# EAGLE design booz_power_board (EAGLE 4.16)
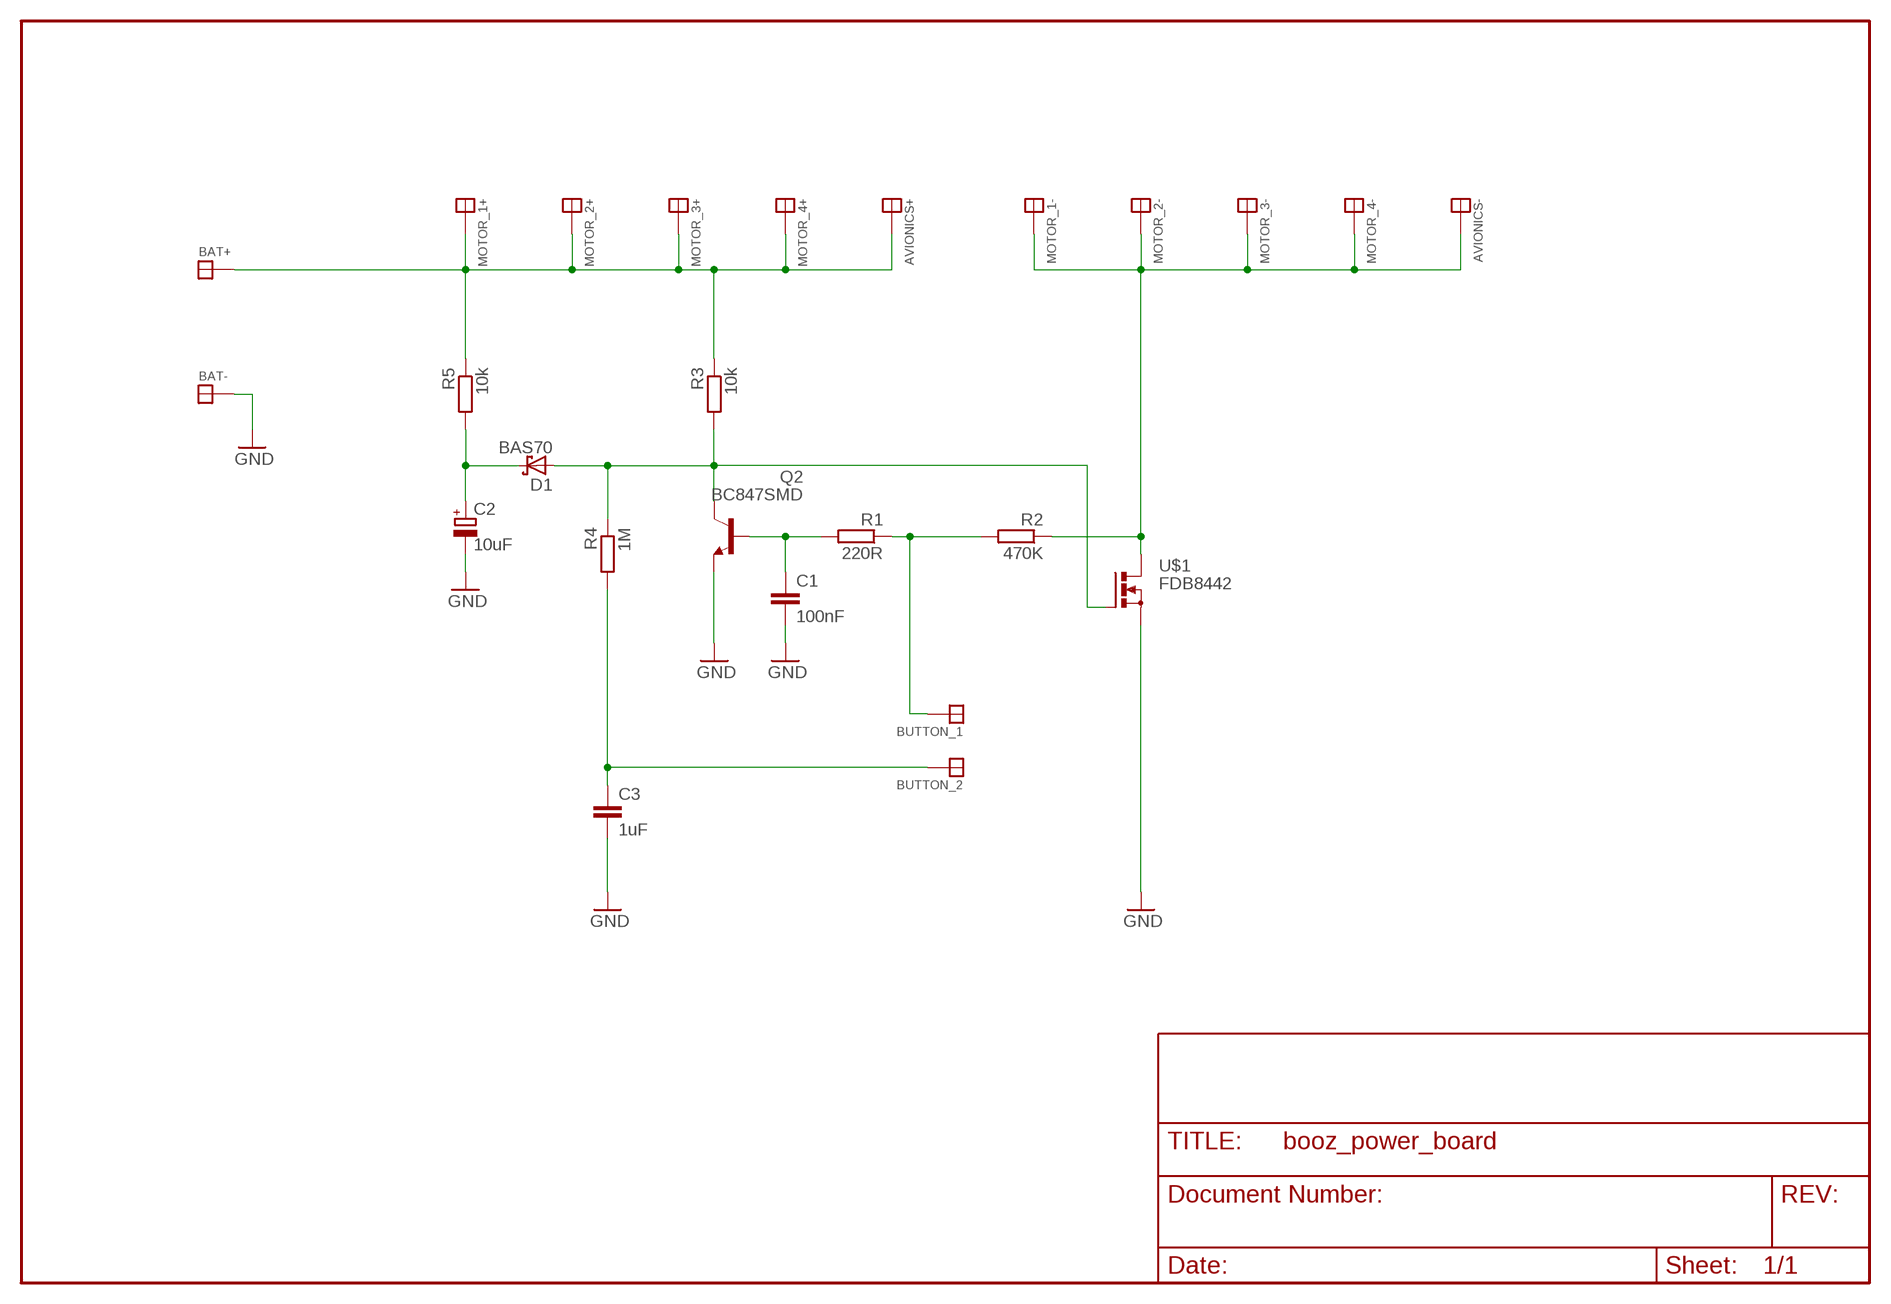
[diagram p0: schematic, sheet 1]

## Parts
AVIONICS+  SOLDER_PAD100_50  [SOLDER_PAD_100_50]
AVIONICS-  SOLDER_PAD100_50  [SOLDER_PAD_100_50]
BAT+  SOLDER_PAD100_50  [SOLDER_PAD_100_50]
BAT-  SOLDER_PAD100_50  [SOLDER_PAD_100_50]
BUTTON_1  SOLDER_PAD100_50  [SOLDER_PAD_100_50]
BUTTON_2  SOLDER_PAD100_50  [SOLDER_PAD_100_50]
C1  100nF  C-EUC0603  [C0603]
C2  10uF  CPOL-EUSMCA  [SMC_A]
C3  1uF  C-EUC0603  [C0603]
D1  BAS70  [SOT23]
MOTOR_1+  SOLDER_PAD100_50  [SOLDER_PAD_100_50]
MOTOR_1-  SOLDER_PAD100_50  [SOLDER_PAD_100_50]
MOTOR_2+  SOLDER_PAD100_50  [SOLDER_PAD_100_50]
MOTOR_2-  SOLDER_PAD100_50  [SOLDER_PAD_100_50]
MOTOR_3+  SOLDER_PAD100_50  [SOLDER_PAD_100_50]
MOTOR_3-  SOLDER_PAD100_50  [SOLDER_PAD_100_50]
MOTOR_4+  SOLDER_PAD100_50  [SOLDER_PAD_100_50]
MOTOR_4-  SOLDER_PAD100_50  [SOLDER_PAD_100_50]
Q2  BC847SMD  [SOT23]
R1  220R  R-EU_R1206  [R1206]
R2  470K  R-EU_R0603  [R0603]
R3  10k  R-EU_R1206  [R1206]
R4  1M  R-EU_R0603  [R0603]
R5  10k  R-EU_R0603  [R0603]
U$1  FDB8442  [TO263]

## Nets
GND: BAT-.P$1 C1.2 C2.- C3.2 Q2.2(E) U$1.2(S)
N$1: AVIONICS+.P$1 BAT+.P$1 MOTOR_1+.P$1 MOTOR_2+.P$1 MOTOR_3+.P$1 MOTOR_4+.P$1 R3.1 R5.1
N$2: C1.1 Q2.1(B) R1.2
N$3: BUTTON_1.P$1 R1.1 R2.2
N$4: BUTTON_2.P$1 C3.1 R4.2
N$5: AVIONICS-.P$1 MOTOR_1-.P$1 MOTOR_2-.P$1 MOTOR_3-.P$1 MOTOR_4-.P$1 R2.1 U$1.3(D)
N$7: D1.1(A) Q2.3(C) R3.2 R4.1 U$1.1(G)
N$8: C2.+ D1.3(C) R5.2

## Library data of the parts
AVIONICS+ AVIONICS- BAT+ BAT- BUTTON_1 BUTTON_2 MOTOR_1+ MOTOR_1- MOTOR_2+ MOTOR_2- MOTOR_3+ MOTOR_3- MOTOR_4+ MOTOR_4- = paparazzi:SOLDER_PAD
C1 C3 = rcl:C-EU: CAPACITOR, European symbol
C2 = rcl:CPOL-EU: POLARIZED CAPACITOR, European symbol
D1 = diode:BAS70: Silicon Schottky Diodes General-purpose diode for high-speed switching
Q2 = transistor-npn:BC847*: NPN Transistor
R1-R5 = rcl:R-EU_: RESISTOR, European symbol
U$1 = booz:FDB8442

## Board
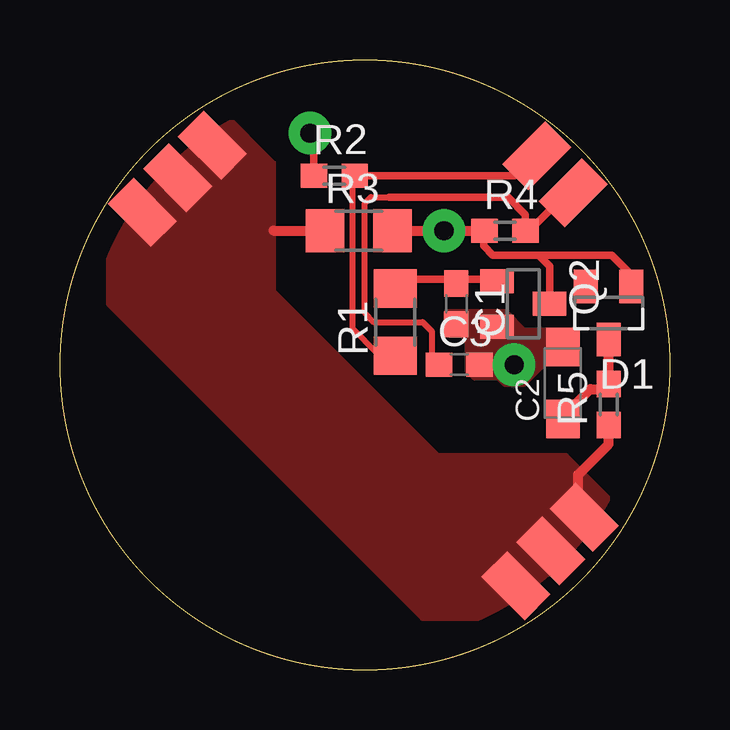
[diagram p1: board, top side]
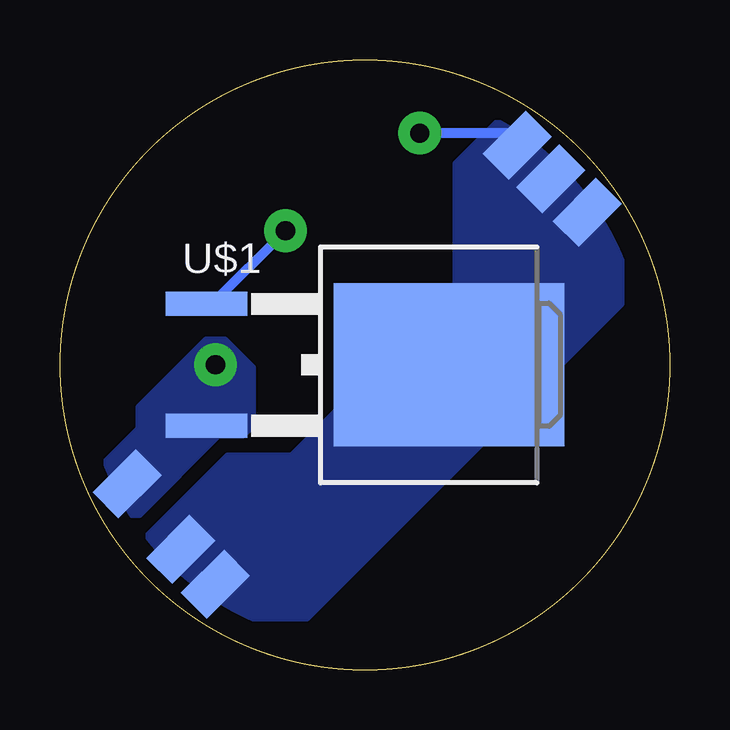
[diagram p2: board, bottom side, seen from below]

Size 25.4 x 25.4 mm. Coordinates in mm from the lower left corner, seen from the top.
Outline: circle at 12.7,12.7 radius 12.7
Copper layers (1*16): Top 0.035mm / dielectric 1.5mm / Bottom 0.035mm
Design rules "default": minimum track width 10mil, minimum drill 24mil, track to track 8mil, track to pad 8mil, pad to pad 8mil, via to via 8mil, smd to smd 8mil, copper to edge 40mil, drill to drill 8mil, minimum pad ring 10mil, minimum via ring 8mil, stop-mask expansion 4mil, vias tented up to drill 0mil, thermal gap 10mil

### Footprints (pad centres in the part's own frame; a part is rotated, then mirrored left to right if it is on the bottom)
SOLDER_PAD_100_50 = smd 2.54 x 1.524: P$1 0,0
C0603 = smd 1.1 x 1: 1 -0.85,0; 2 0.85,0
SMC_A = smd 1.6 x 1.4: + -1.5,0; - 1.5,0
SOT23 = smd 1 x 1.4: 1 -0.95,-1.1; 2 0.95,-1.1; 3 0,1.1
R1206 = smd 1.6 x 1.8: 1 -1.4,0; 2 1.4,0
R0603 = smd 1.1 x 1: 1 -0.85,0; 2 0.85,0
TO263 = smd 1 x 3.4: 1 -2.54,-6.6; 2 2.54,-6.6 | smd 6.8 x 9.6: 3 0,3.5

### Placement (x,y rotation side)
AVIONICS+  4.9,20.5 135 top
AVIONICS-  4.95,20.45 45 bottom
BAT+  20.45,4.95 135 top
BAT-  22.61,7.75 45 bottom
BUTTON_1  19.86,21.41 225 top
BUTTON_2  21.39,19.86 45 top
C1  16.51,15.24 270 top
C2  20.95,11.94 90 top
C3  16.64,12.7 0 top
D1  22.86,14.86 180 top
MOTOR_1+  21.84,6.35 315 top
MOTOR_1-  18.92,3.56 45 bottom
MOTOR_2+  19,3.5 135 top
MOTOR_2-  20.37,5.01 45 bottom
MOTOR_3+  3.43,19.05 135 top
MOTOR_3-  3.43,19.05 225 bottom
MOTOR_4+  6.35,21.84 135 top
MOTOR_4-  6.35,21.84 45 bottom
Q2  19.3,15.24 270 top
R1  13.97,14.48 90 top
R2  11.43,20.57 0 top
R3  12.45,18.29 0 top
R4  18.54,18.29 0 top
R5  22.86,11.05 90 top
U$1  12.7,12.7 270 bottom

### Tracks (layer width: path | path; a pad name or v marks a point on that pad's centre or on a via)
GND  (via drill 0.8 pad 1.78)
  Top 0.254: 18.27,14.22 18.29,14.22
  other vias: 18.92,12.7
  pour Top (no thermals): 16.13,14.86 18.54,14.86 19.3,14.1 21.46,14.1 21.46,13.08 21.21,12.83 20.19,12.83 19.3,11.94 18.54,11.94 18.29,12.19 17.27,12.19 17.02,12.45 17.02,13.72 16.76,13.97 16.26,13.97 16.13,14.1
  pour Bottom (no thermals): 23.88,8 23.88,7.37 22.99,6.48 22.1,6.48 18.8,9.78 17.78,9.78 17.4,10.16 17.4,12.57 18.54,13.72 19.3,13.72 22.1,10.92 22.1,10.03 23.75,8.38 23.88,8.26
N$1
  Top 0.406: 8.89,18.29 R3.1 | R5.1 22.86,9.4 21.59,8.13 21.59,6.6 MOTOR_1+.P$1
  pour Top (no thermals): 2.03,19.43 2.03,15.24 8.64,8.64 15.11,2.16 19.3,2.16 23.24,6.1 23.24,6.73 21.08,8.89 19.69,8.89 15.75,8.89 8.89,15.75 8.89,21.08 6.73,23.24 6.1,23.24 5.84,23.24
N$2
  Top 0.254: 18.14,16.26 Q2.1 | C1.1 16.68,16.26
  Top 0.305: 16.68,16.26 18.14,16.26 | C1.1 16.51,16.26 14.35,16.26 R1.2
N$3
  Top 0.254: 12.19,20.32 12.19,14.22 13.21,13.21 13.97,13.21 R1.1 | 19.81,21.46 BUTTON_1.P$1 | BUTTON_1.P$1
  Top 0.305: 19.81,21.46 18.92,20.57 12.45,20.57 | 12.45,20.57 R2.2 | 12.19,20.32 12.45,20.57
N$4
  Top 0.254: C3.1 15.49,12.87 15.49,14.1 15.11,14.48 13.08,14.48 12.7,14.86 12.7,19.43 12.95,19.69 13.72,19.69 | 21.34,19.94 21.39,19.89 BUTTON_2.P$1
  Top 0.305: 21.39,19.89 21.16,19.89 19.56,18.29 R4.2 19.39,18.96 18.67,19.69 13.72,19.69
N$5  (via drill 0.8 pad 1.78)
  Top 0.305: R2.1 10.58,22.19 v10.41,22.35
  Bottom 0.406: MOTOR_4-.P$1 6.6,21.84 6.6,22.35 v10.41,22.35
  pour Bottom (no thermals): 2.03,19.43 2.03,15.24 15.11,2.16 19.3,2.16 21.84,4.83 21.84,5.46 18.42,8.89 15.75,8.89 8.89,15.75 8.89,21.08 6.73,23.24 5.84,23.24
N$7  (via drill 0.8 pad 1.78)
  Top 0.305: Q2.3 20.4,16.81 19.94,17.27 19.81,17.27 | 19.81,17.27 18.03,17.27 17.65,17.65 17.65,18.29 | D1.1 23.81,16.45 22.99,17.27 19.81,17.27
  Top 0.406: 17.78,18.29 R4.1 17.65,18.29 v16,18.29 R3.2
  Bottom 0.406: U$1.1 19.05,15.24 v16,18.29
N$8
  Top 0.406: D1.3 R5.2 22.86,11.68 22.1,11.68 20.83,10.41 C2.+